# Altium schematic sheet CAN_IF.SchDoc
size B; SheetNumber: 7; SheetTotal: 8
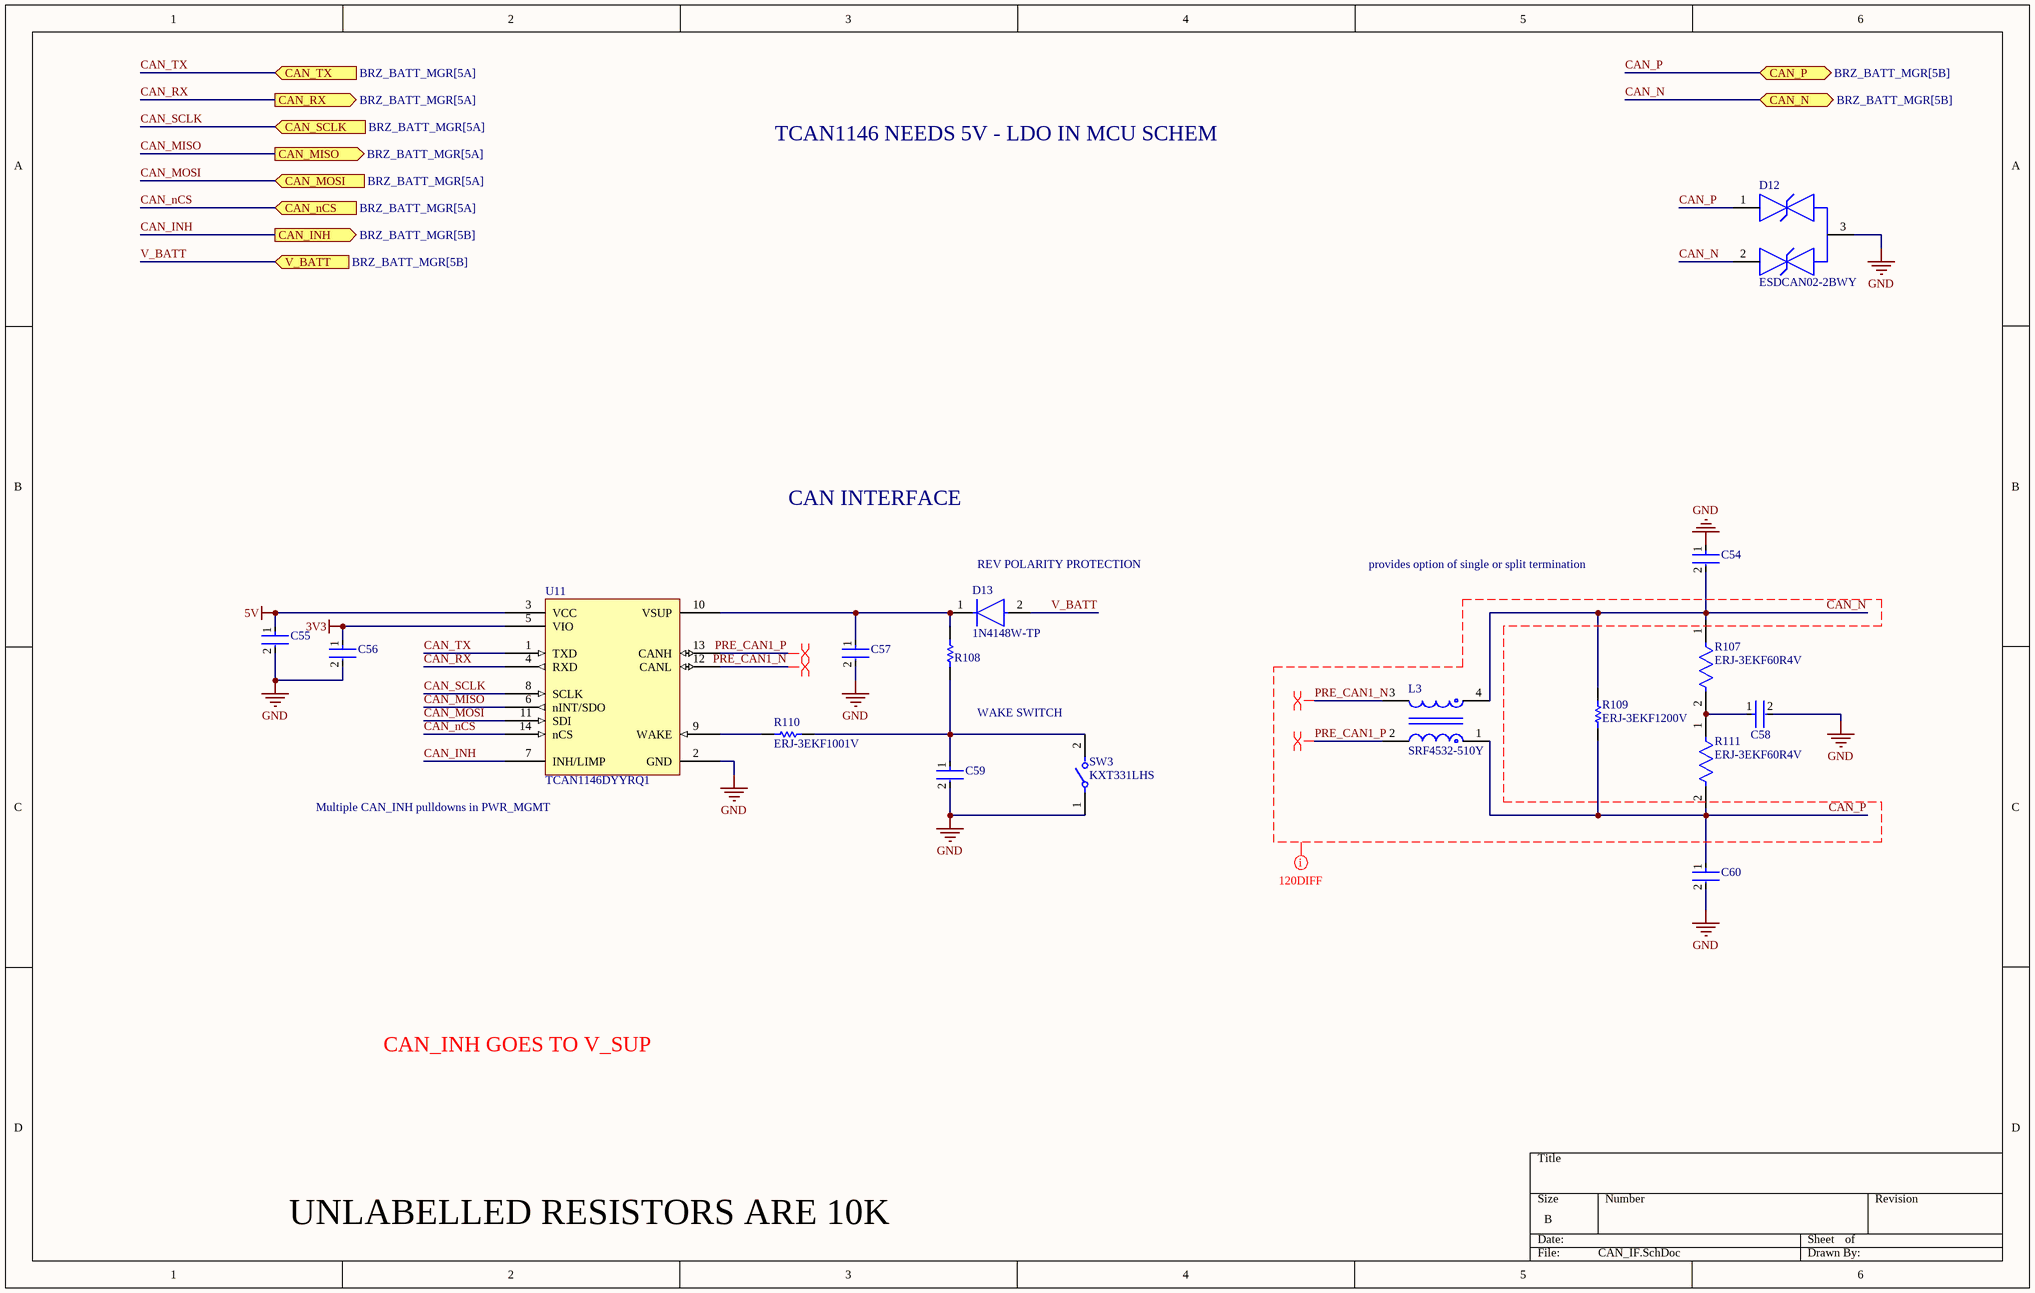
[diagram p0: CAN_IF.SchDoc]

## Parts
C54  6.6p 10v  [FP-0402-L_1_0_0_05-W_0_5-IPC_A]  (value not drawn)
C55  100n 10v  [FP-0402-L_1_0_0_05-W_0_5-IPC_A]  (value not drawn)
C56  100n 10v  [FP-0402-L_1_0_0_05-W_0_5-IPC_A]  (value not drawn)
C57  100n 10v  [FP-0402-L_1_0_0_05-W_0_5-IPC_A]  (value not drawn)
C58  100n 10v  [FP-0402-L_1_0_0_05-W_0_5-IPC_A]  (value not drawn)
C59  100n 10v  [FP-0402-L_1_0_0_05-W_0_5-IPC_A]  (value not drawn)
C60  6.6p 10v  [FP-0402-L_1_0_0_05-W_0_5-IPC_A]  (value not drawn)
D12  ESDCAN02-2BWY  [FP-SOT323-3L-MFG]
D13  1N4148W-TP  [FP-SOD-123-IPC_A]
L3  SRF4532-510Y  [FP-SRF4532-MFG]
R107  ERJ-3EKF60R4V  [FP-ERJ3EK-IPC_C]
R108  ERJ3EKF1002V  [RESC1609X55X30LL15T15]  (value not drawn)
R109  ERJ-3EKF1200V  [RESC1609X55X30ML15T15]
R110  ERJ-3EKF1001V  [RESC1608X55X30LL15T15]
R111  ERJ-3EKF60R4V  [FP-ERJ3EK-IPC_C]
SW3  KXT331LHS  [FP-KXT331LHS-MFG]
U11  TCAN1146DYYRQ1  [TCAN1146DYYRQ1-Footprint-1]

## Ports
CAN_INH (out, see BRZ_BATT_MGR[5B]), CAN_MISO (out, see BRZ_BATT_MGR[5A]), CAN_MOSI (in, see BRZ_BATT_MGR[5A]), CAN_N (bidir, see BRZ_BATT_MGR[5B]), CAN_nCS (in, see BRZ_BATT_MGR[5A]), CAN_P (bidir, see BRZ_BATT_MGR[5B]), CAN_RX (out, see BRZ_BATT_MGR[5A]), CAN_SCLK (in, see BRZ_BATT_MGR[5A]), CAN_TX (in, see BRZ_BATT_MGR[5A]), V_BATT (in, see BRZ_BATT_MGR[5B])

## Nets
3V3: C56.1 U11.5(VIO)
5V: C55.1 U11.3(VCC)
GND: C54.1 C55.2 C56.2 C57.2 C58.2 C59.2 C60.2 D12.3 SW3.1 U11.2(GND)
CAN_INH: U11.7(INH/LIMP) ; port CAN_INH
CAN_MISO: U11.6(nINT/SDO) ; port CAN_MISO
CAN_MOSI: U11.11(SDI) ; port CAN_MOSI
CAN_N: C54.2 D12.2 L3.4 R107.1 R109.1 ; port CAN_N
CAN_nCS: U11.14(nCS) ; port CAN_nCS
CAN_P: C60.1 D12.1 L3.1 R109.2 R111.2 ; port CAN_P
CAN_RX: U11.4(RXD) ; port CAN_RX
CAN_SCLK: U11.8(SCLK) ; port CAN_SCLK
CAN_TX: U11.1(TXD) ; port CAN_TX
PRE_CAN1_N: L3.3 U11.12(CANL)
PRE_CAN1_P: L3.2 U11.13(CANH)
V_BATT: D13.2(A) ; port V_BATT
NetC57_1: C57.1 D13.1(C) R108.1 U11.10(VSUP)
NetC58_1: C58.1 R107.2 R111.1
NetC59_1: C59.1 R108.2 R110.2 SW3.2
NetR110_1: R110.1 U11.9(WAKE)

## Layout directives
differential pair: PRE_CAN1_N, PRE_CAN1_P
net class 120DIFF: CAN_N, CAN_P, PRE_CAN1_N, PRE_CAN1_P

## Notes on the sheet
- TCAN1146 NEEDS 5V - LDO IN MCU SCHEM
- CAN INTERFACE
- (near D13) REV POLARITY PROTECTION
- provides option of single or split termination
- WAKE SWITCH
- (near U11) Multiple CAN_INH pulldowns in PWR_MGMT
- CAN_INH GOES TO V_SUP
- UNLABELLED RESISTORS ARE 10K

## Library data of the parts
C54-C60 = CMP-001-00058-1: LARGE PADS, 0402 CAP, CHANGE COMMENT TO MATCH REAL P/N; Capacitor Type: Ceramic; Min Operating Temperature: -55°C; Mounting Technology: Surface Mount; Pins: 2; Case/Package: 0402; RoHS Compliant: Yes; Max Operating Temperature: 85°C
D12 = CMP-12225-000055-1: TVS DIODE 26.5V 44V SOT323-3; Manufacturer: STMicroelectronics; Value: 3pF; Direction: Bidirectional; Breakdown Voltage: 28.5V; Automotive Grade: Grade 0; Standoff Height: 0mm; Peak Pulse Power: 170W; Peak Pulse Current: 3A; Number Of Channels: 2; Max Junction Temp: +175°C; Mouser Description: TVS Diodes / ESD Suppressors Automotive dual-line Transil, Transient voltage suppressor (TVS) for CAN bus; Height: 1.1mm; Category: Diode; Reverse Standoff Voltage: 26.5V; Device Class L1: Circuit Protection; Temperature: -55°C to +175°C; RoHS: TRUE; ComponentLink2URL: https://www.st.com/resource/en/datasheet/esdcan02-2bwy.pdf; Device Class L3: unset; Device Class L2: TVS Diodes; Temperature Range High: +175°C; Octopart: https://octopart.com/esdcan02-2bwy-stmicroelectronics-58631133; Ipc Land Pattern Name: SOT65P210X95-3; Temperature Range Low: -55°C; Capacitance: 3pF; Digikey Description: TVS DIODE 26.5V 44V SOT323-3; Automotive: Yes; ComponentLink2Description: Datasheet; Clamping Voltage: 44V; Manufacturer Part Number: ESDCAN02-2BWY; Lead Free: Yes; Package: SOT323-3L
D13 = CMP-2000-04993-2: DIODE GEN PURP 100V 150MA SOD123; Max Reverse Leakage Current: 5uA; Max Surge Current: 2A; Reverse Recovery Time: 4ns; Polarity: Standard; Capacitance: 4pF; Max Forward Surge Current (Ifsm): 1A; Element Configuration: Single; Power Dissipation: 400mW; Forward Voltage: 1V; Radiation Hardening: No; Lead Free: Lead Free; Max Reverse Voltage (DC): 100V; Current Rating: 150mA; Forward Current: 150mA; Packaging: Tape and Reel; Number of Pins: 2; Package Quantity: 3000; Max Operating Temperature: 150°C; Min Operating Temperature: -65°C; Average Rectified Current: 150mA; Recovery Time: 4ns; Output Current: 150mA; Peak Non-Repetitive Surge Current: 2A; Width: 1.8mm; Voltage Rating (DC): 100V; Height: 1.2mm; Max Repetitive Reverse Voltage (Vrrm): 100V; Mount: Surface Mount; Length: 2.85mm
L3 = CMP-07251-000006-1: CMC 51UH 200MA 2LN 2KOHM SMD; Element Configuration: Dual; Number of Lines: 2; Core Material: Ferrite; Impedance: 2kR; Test Frequency: 100kHz; Voltage Rating (DC): 50V; Insulation Resistance: 10MR; Material: Steel; Tolerance: 50%; DC Resistance (DCR): 3.5R; RoHS Compliant: Yes; Mount: Surface Mount; REACH SVHC: No SVHC; Termination: SMD/SMT; DC Current: 200mA; Current: 200mA; Lead Free: Lead Free; Contact Plating: Tin; Length: 4.5mm; Max DC Current: 200mA; Width: 0.126inch; Case/Package: 4532; Packaging: Tape and Reel; Package Quantity: 1; Min Operating Temperature: -40°C; Depth: 3.4mm; Series: SRF4532; Max Operating Temperature: 125°C; Current Rating: 200mA; Self Resonant Frequency: 100kHz; Height: 0.118inch; Inductance: 51uH; Resistance: 2kR
R107 R111 = CMP-1012-00372-3: RES SMD 60.4 OHM 1% 1/10W 0603; Resistance: 60.4R; Voltage Rating (DC): 50V; Voltage Rating: 75V; Temperature Coefficient: 100ppm/°C; Power Rating: 100mW; Mount: Surface Mount; Number of Terminations: 2; Max Operating Temperature: 155°C; Case Code (Metric): 1608; Height: 0.022inch; Case/Package: 0603; Min Operating Temperature: -55°C; REACH SVHC: No SVHC; Series: ERJ; Features: Automotive AEC-Q200; Military Standard: Not; Lead Free: Lead Free; Width: 0.031inch; Case Code (Imperial): 0603; Resistance Tolerance: 1%; Packaging: Tape and Reel; Termination: SMD/SMT; Tolerance: 1%; Contact Plating: Tin; Depth: 0.8mm; Resistor Type: Thick Film; Construction: Rectangular; RoHS Compliant: Yes; Max Power Dissipation: 100mW; Package Quantity: 1; Length: 1.6mm
R108 = CMP-1012-00623-3: Chip Resistor, 10 KOhm, +/- 1%, 0.1 W, -55 to 155 degC, 0603 (1608 Metric), RoHS, Tape and Reel; Manufacturer: Panasonic; Voltage Rating: 75V; Case\/Package: 0603; Power Rating: 100mW; Resistance: 10KOhm; Temperature Coefficient: 100ppm\/degreesC; Number of Pins: 2; Package Reference: 603; Depth: 0.8mm; Mount: SurfaceMount; Package Description: 2-Pin Surface Mount Device, Body 1.6 x 0.85 mm; Datasheet Version: 02/2017; Length: 1.6mm; Lead Free: LeadFree; Height: 0.45mm; Number of Terminations: 2; Max Power Dissipation: 100mW; Min Operating Temperature: -55degC; Datasheet URL: https://industrial.panasonic.com/cdbs/www-data/pdf/RDA0000/AOA0000C304.pdf; Termination: SMD/SMT; Case Code (Metric): 1608; Case Code (Imperial): 0603; Tolerance: 1%; Max Operating Temperature: 155degC; RoHSCompliant: true; Voltage Rating (DC): 75V; Radiation Hardening: No; Packaging: TapeandReel; Composition: ThickFilm; Mounting Technology: SurfaceMount; Manufacturer URL: http://www.panasonic.com/; Width: 0.031inch; REACH SVHC: NoSVHC; Contact Plating: Tin; Military Standard: Not; Package Quantity: 1
R109 = CMP-2000-00213-2: Chip Resistor, 120 Ohm, +/- 1%, 0.1 W, -55 to 155 degC, 0603 (1608 Metric), RoHS, Tape and Reel; Manufacturer: Panasonic; Power Rating: 100mW; Voltage Rating (DC): 75V; Resistance: 120Ohm; Temperature Coefficient: 100ppm/degreesC; Number of Terminations: 2; Military Standard: Not; Tolerance: 1%; Min Operating Temperature: -55degC; Packaging: TapeandReel; Lead Free: LeadFree; Max Operating Temperature: 155degC; Manufacturer URL: http://www.panasonic.com/; Case Code (Imperial): 0603; REACH SVHC: NoSVHC; Width: 0.031inch; Datasheet URL: https://industrial.panasonic.com/cdbs/www-data/pdf/RDA0000/AOA0000C283.pdf; RoHSCompliant: true; Max Power Dissipation: 100mW; Termination: SMD/SMT; Package Reference: 0603; Height: 0.022inch; Depth: 0.8mm; Package Description: 2-Pin Surface Mount Device, Body 1.6 x 0.85 mm; Contact Plating: Tin; Length: 1.6mm; Package URL: http://www.st.com/st-web-ui/static/active/en/resource/technical/document/datasheet/CD00001320.pdf; Radiation Hardening: No; Package Quantity: 1; Number of Pins: 2; Datasheet Version: 42095.0; Voltage Rating: 75V; Composition: ThickFilm; Case/Package: 0603; Mount: SurfaceMount; Case Code (Metric): 1608
R110 = CMP-2000-00180-1: Manufacturer: Panasonic; Part Number: ERJ-3EKF1001V
SW3 = CMP-10040-000029-1: SWITCH TACTILE SPST-NO 0.02A 15V; Operating Force: 240gf; Switch Travel: 0.13mm; Illumination Type: Non-Illuminated; Throw Configuration: SPST; Number of Ports: 1; Current Rating: 5A; Mechanical Life: 500000Cycles; Switch Function: Off-Mom; Connector Type: USB; Actuator Type: Standard; Gender: Receptacle; Number of Contacts: 24; Contact Plating: Gold; Insulation Color: Black; Min Operating Temperature: -40°C; Packaging: Tape and Reel; Flammability Rating: UL94 V-0; Max Operating Temperature: 85°C; Termination: Solder; Mount: Surface Mount
U11 = CMP-015-00012-2: Automotive CAN FD transceiver with watchdog, bus diagnostics and partial networking via sele 14-SOT-23-THIN -40 to 150